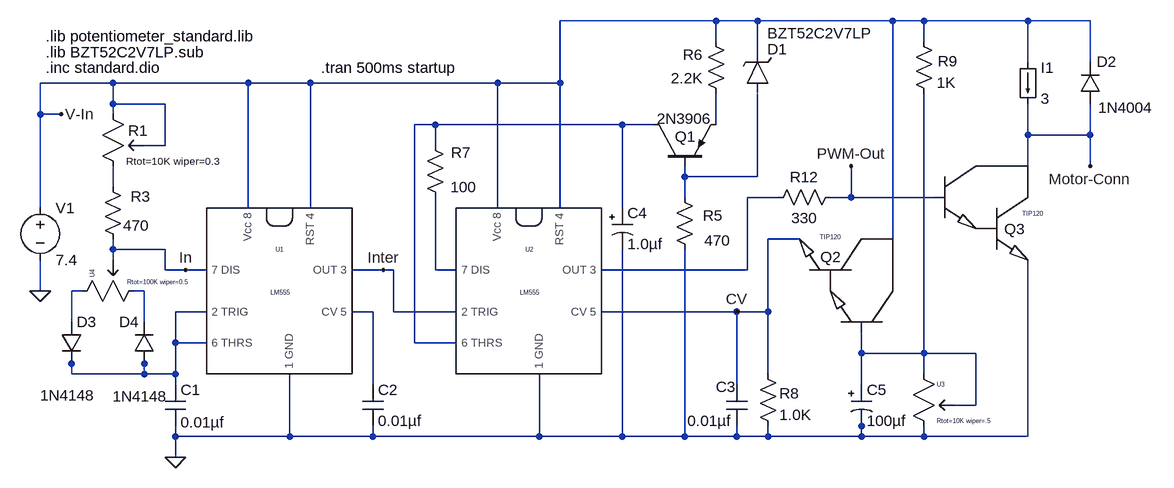
[diagram p0: schematic PWMMotorController.asc]
PWMMotorController.asc, the LTspice schematic file:
Version 4
SHEET 1 1620 680
WIRE 736 -240 496 -240
WIRE 800 -240 736 -240
WIRE 1008 -240 800 -240
WIRE 1056 -240 1008 -240
WIRE 1216 -240 1056 -240
WIRE 1312 -240 1216 -240
WIRE 736 -208 736 -240
WIRE 1056 -208 1056 -240
WIRE 800 -192 800 -240
WIRE 1216 -176 1216 -240
WIRE 1312 -176 1312 -240
WIRE -192 -144 -304 -144
WIRE 16 -144 -192 -144
WIRE 112 -144 16 -144
WIRE 400 -144 112 -144
WIRE 496 -144 496 -240
WIRE 496 -144 400 -144
WIRE -192 -112 -192 -144
WIRE -112 -112 -192 -112
WIRE -304 -96 -304 -144
WIRE -272 -96 -304 -96
WIRE -192 -96 -192 -112
WIRE 304 -80 272 -80
WIRE 592 -80 304 -80
WIRE 640 -80 592 -80
WIRE 736 -80 736 -128
WIRE 1216 -64 1216 -112
WIRE 1312 -64 1312 -112
WIRE 1312 -64 1216 -64
WIRE -112 -48 -112 -112
WIRE -112 -48 -144 -48
WIRE 304 -48 304 -80
WIRE 1216 -16 1216 -64
WIRE 1312 -16 1312 -64
WIRE 688 0 688 -16
WIRE 800 0 800 -128
WIRE 800 0 688 0
WIRE -192 16 -192 -16
WIRE 688 32 688 0
WIRE 832 32 784 32
WIRE 944 32 944 -16
WIRE 944 32 912 32
WIRE 1072 32 944 32
WIRE -304 48 -304 -96
WIRE 16 48 16 -144
WIRE 112 48 112 -144
WIRE 400 48 400 -144
WIRE 496 48 496 -144
WIRE 592 48 592 -80
WIRE 864 96 816 96
WIRE 1008 96 1008 -240
WIRE -192 112 -192 96
WIRE -112 112 -192 112
WIRE -192 128 -192 112
WIRE -112 144 -112 112
WIRE -80 144 -112 144
WIRE -48 144 -80 144
WIRE 224 144 176 144
WIRE 240 144 224 144
WIRE 304 144 304 32
WIRE 336 144 304 144
WIRE 784 144 784 32
WIRE 784 144 560 144
WIRE -304 176 -304 128
WIRE -240 176 -256 176
WIRE -144 176 -160 176
WIRE -48 208 -96 208
WIRE 208 208 176 208
WIRE 240 208 240 144
WIRE 336 208 240 208
WIRE 768 208 560 208
WIRE 816 208 816 96
WIRE 816 208 768 208
WIRE -256 224 -256 176
WIRE -144 224 -144 176
WIRE -96 256 -96 208
WIRE -48 256 -96 256
WIRE 272 256 272 -80
WIRE 336 256 272 256
WIRE 960 272 960 240
WIRE 1056 272 1056 -128
WIRE 1056 272 960 272
WIRE 1136 272 1056 272
WIRE -256 288 -256 272
WIRE -144 288 -144 272
WIRE -256 304 -256 288
WIRE -144 304 -144 288
WIRE -144 304 -256 304
WIRE -96 304 -96 256
WIRE -96 304 -144 304
WIRE 816 304 816 208
WIRE 1056 304 1056 272
WIRE -96 320 -96 304
WIRE 208 320 208 208
WIRE 768 320 768 208
WIRE 960 320 960 272
WIRE 1136 352 1136 272
WIRE 1136 352 1104 352
WIRE 960 384 960 368
WIRE -96 400 -96 384
WIRE 80 400 80 304
WIRE 80 400 -96 400
WIRE 208 400 208 384
WIRE 208 400 80 400
WIRE 464 400 464 304
WIRE 464 400 208 400
WIRE 592 400 592 112
WIRE 592 400 464 400
WIRE 688 400 688 112
WIRE 688 400 592 400
WIRE 768 400 768 384
WIRE 768 400 688 400
WIRE 816 400 816 384
WIRE 816 400 768 400
WIRE 960 400 960 384
WIRE 960 400 816 400
WIRE 1056 400 1056 384
WIRE 1056 400 960 400
WIRE 1216 400 1216 128
WIRE 1216 400 1056 400
WIRE -96 432 -96 400
FLAG -96 432 0
FLAG -304 176 0
FLAG 944 -16 PWM-Out
FLAG -80 144 In
FLAG 224 144 Inter
FLAG 768 208 CV
FLAG 1312 -16 Motor-Conn
FLAG -272 -96 V-In
SYMBOL LM555 64 176 R0
SYMATTR InstName U1
SYMBOL LM555 448 176 R0
SYMATTR InstName U2
SYMBOL res 320 48 R180
WINDOW 0 -39 85 Left 2
WINDOW 3 -48 32 Left 2
SYMATTR InstName R7
SYMATTR Value 100
SYMBOL res 704 128 R180
WINDOW 0 -43 68 Left 2
WINDOW 3 -55 30 Left 2
SYMATTR InstName R5
SYMATTR Value 470
SYMBOL res 832 400 R180
WINDOW 0 -32 66 Left 2
WINDOW 3 -51 33 Left 2
SYMATTR InstName R8
SYMATTR Value 1.0K
SYMBOL res 1072 -112 R180
WINDOW 0 -36 66 Left 2
WINDOW 3 -33 33 Left 2
SYMATTR InstName R9
SYMATTR Value 1K
SYMBOL res 752 -112 R180
WINDOW 0 36 76 Left 2
WINDOW 3 36 40 Left 2
SYMATTR InstName R6
SYMATTR Value 2.2K
SYMBOL cap -112 320 R0
WINDOW 3 24 58 Left 2
SYMATTR Value 0.01µf
SYMATTR InstName C1
SYMBOL cap 192 320 R0
SYMATTR InstName C2
SYMATTR Value 0.01µf
SYMBOL cap 752 320 R0
WINDOW 0 -16 4 Left 2
WINDOW 3 -60 56 Left 2
SYMATTR InstName C3
SYMATTR Value 0.01µf
SYMBOL potentiometer -208 -112 R0
WINDOW 0 39 41 Left 2
WINDOW 3 36 88 Left 1
SYMATTR InstName R1
SYMATTR Value Rtot=10K wiper=0.3
SYMBOL pnp 640 -16 R270
WINDOW 0 46 33 VRight 2
WINDOW 3 73 5 VRight 2
SYMATTR InstName Q1
SYMATTR Value 2N3906
SYMBOL polcap 576 48 R0
SYMATTR InstName C4
SYMATTR Value 1.0µf
SYMBOL voltage -304 32 R0
WINDOW 123 0 0 Left 0
WINDOW 39 0 0 Left 0
SYMATTR InstName V1
SYMATTR Value 7.4
SYMBOL polcap 944 320 R0
SYMATTR InstName C5
SYMATTR Value 100µf
SYMBOL TIP120 1008 224 M270
WINDOW 0 100 111 VLeft 2
WINDOW 3 131 96 VCenter 0
SYMATTR InstName Q2
SYMBOL TIP120 1088 -16 R0
WINDOW 0 92 97 Left 2
WINDOW 3 136 73 Center 0
SYMATTR InstName Q3
SYMBOL diode 1328 -112 R180
WINDOW 0 -25 65 Left 2
WINDOW 3 -81 -6 Left 2
SYMATTR InstName D2
SYMATTR Value 1N4004
SYMBOL res 928 16 R90
WINDOW 0 0 56 VBottom 2
WINDOW 3 32 56 VTop 2
SYMATTR InstName R12
SYMATTR Value 330
SYMBOL load 1200 -176 R0
WINDOW 123 0 0 Left 0
WINDOW 39 0 0 Left 0
SYMATTR InstName I1
SYMATTR Value 3
SYMBOL potentiometer 1040 288 R0
SYMATTR InstName U3
SYMBOL res -176 112 R180
WINDOW 0 -42 81 Left 2
WINDOW 3 -40 37 Left 2
SYMATTR InstName R3
SYMATTR Value 470
SYMBOL potentiometer -256 192 R270
WINDOW 3 30 86 VRight 0
SYMATTR Value Rtot=100K wiper=0.5
SYMATTR InstName U4
SYMBOL diode -272 224 R0
WINDOW 3 -32 113 Left 2
SYMATTR Value 1N4148
SYMATTR InstName D3
SYMBOL diode -128 288 R180
WINDOW 0 24 64 Left 2
WINDOW 3 -20 -50 Left 2
SYMATTR InstName D4
SYMATTR Value 1N4148
SYMBOL zener_generic 800 -160 R270
WINDOW 3 61 15 VRight 2
WINDOW 0 36 15 VRight 2
SYMATTR Value BZT52C2V7LP
SYMATTR InstName D1
TEXT -296 -168 Left 2 !.inc standard.dio
TEXT -296 -216 Left 2 !.lib potentiometer_standard.lib
TEXT 128 -168 Left 2 !.tran 500ms startup
TEXT -296 -192 Left 2 !.lib BZT52C2V7LP.sub

The netlist it stands for:
* PWMMotorController.asc
XU1 0 N009 Inter V-In N010 N009 In V-In LM555  ; pins 1_GND 2_TRIG OUT_3 RST_4 CV_5 6_THRS 7_DIS Vcc_8
XU2 0 Inter N005 V-In CV N001 N006 V-In LM555  ; pins 1_GND 2_TRIG OUT_3 RST_4 CV_5 6_THRS 7_DIS Vcc_8
R7 N006 N001 100
R5 0 N003 470
R8 0 CV 1.0K
R9 N011 V-In 1K
R6 N002 V-In 2.2K
C1 N009 0 0.01µf
C2 N010 0 0.01µf
C3 CV 0 0.01µf
XR1 V-In N004 V-In potentiometer Rtot=10K wiper=0.3  ; pins A B C
Q1 N001 N003 N002 0 2N3906
C4 N001 0 1.0µf
V1 V-In 0 7.4
C5 N011 0 100µf
XQ2 V-In N011 CV TIP120  ; pins C B E
XQ3 Motor-Conn PWM-Out 0 TIP120  ; pins C B E
D2 Motor-Conn V-In 1N4004
R12 PWM-Out N005 330
I1 V-In Motor-Conn 3
XU3 N011 0 N011 potentiometer Rtot=10K wiper=.5  ; pins A B C
R3 In N004 470
XU4 N007 N008 In potentiometer Rtot=100K wiper=0.5  ; pins A B C
D3 N007 N009 1N4148
D4 N009 N008 1N4148
XD1 N003 V-In BZT52C2V7LP  ; pins P N
.model D D
.lib standard.dio
.model NPN NPN
.model PNP PNP
.lib standard.bjt
.inc standard.dio
.lib potentiometer_standard.lib
.tran 500ms startup
.lib BZT52C2V7LP.sub
.lib LM555.sub
.lib TIP120.sub
.backanno
.end